# Altium schematic sheet [4]-MCU_POWER.SchDoc
size A4
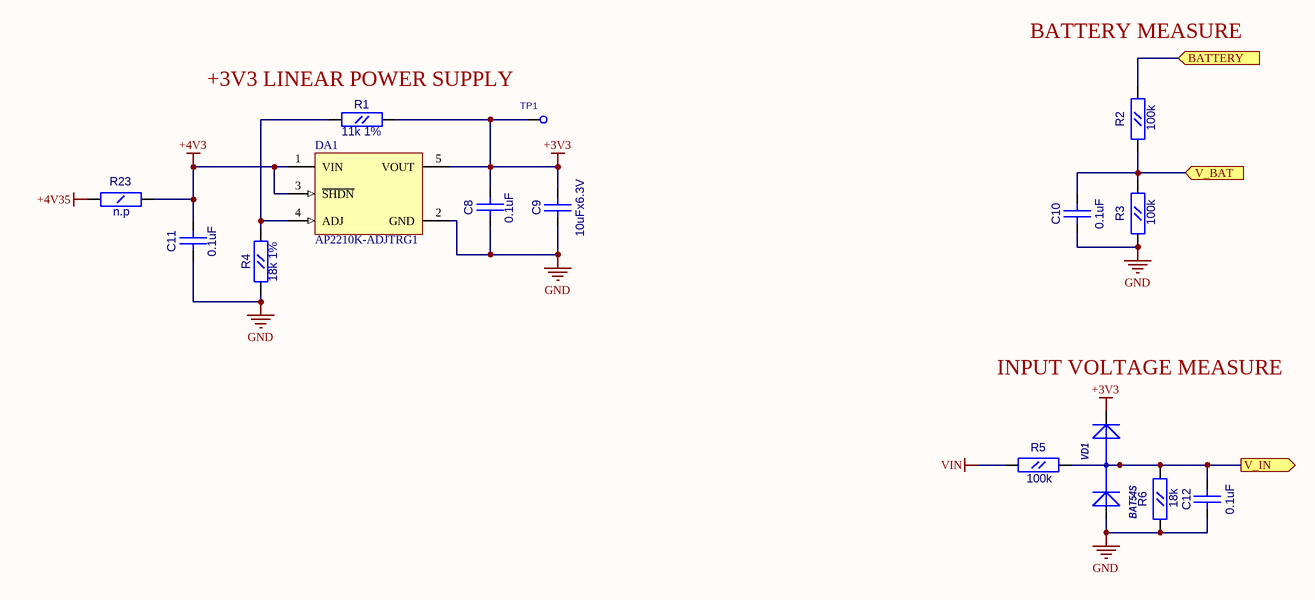
[diagram p0: [4]-MCU_POWER.SchDoc]

## Parts
C8  0.1uF  [CC0603]
C9  10uFx6.3V  [CC0805]
C10  0.1uF  [CC0603]
C11  0.1uF  [CC0603]
C12  0.1uF  [CC0603]
DA1  AP2210K-ADJTRG1  [SOT23-5]
R1  11k 1%  [RC0603]
R2  100k  [RC0603]
R3  100k  [RC0603]
R4  18k 1%  [RC0603]
R5  100k  [RC0603]
R6  18k  [RC0603]
R23  n.p  [RC1206]
TP1  TESTPOINT1  [TESTPOINT1]  (value not drawn)
VD1  BAT54S  [SOT-23(GSD)]

## Ports
BATTERY (in), V_BAT (in), V_IN (out)

## Nets
+3V3: C8.1(A) C9.2(B) DA1.5(VOUT) R1.2(B) TP1.1 VD1.2(K)
+4V3: C11.1(A) DA1.1(VIN) DA1.3(~{SHDN}) R23.2(B)
+4V35: R23.1(A)
GND: C8.2(B) C9.1(A) C10.1(A) C11.2(B) C12.1(A) DA1.2(GND) R3.1(A) R4.1(A) R6.1(A) VD1.1(A)
VIN: R5.1(A)
BATTERY: R2.2(B) ; port BATTERY
V_BAT: C10.2(B) R2.1(A) R3.2(B) ; port V_BAT
V_IN: C12.2(B) R5.2(B) R6.2(B) VD1.3(AK) ; port V_IN
NetDA1_4: DA1.4(ADJ) R1.1(A) R4.2(B)

## Notes on the sheet
- (near R1) +3V3 LINEAR POWER SUPPLY
- BATTERY MEASURE
- (near VD1) INPUT VOLTAGE MEASURE

## Library data of the parts
C8 C10-C12 = CC0603: Value: 0.1uF
C9 = CC0805: Value: 10uFx6.3V
DA1 = MCP1824T-ADJE/OT: 300 mA, Low Voltage, Low Quiescent Current LDO Regulator, 5-Pin SOT-223, Extended Temperature, Tape and Reel; Published: 29-Jan-2009; DatasheetVersion: revA, Aug-2007; PackageVersion: revAW, Oct-2008; PackageReference: SOT-223-DC5; Publisher: Altium Limited; PackageDescription: 5-Lead Plastic Small Outline Transistor (DC) [SOT-223]; ComponentLink1Description: Manufacturer Link; ComponentLink1URL: http://www.microchip.com; ComponentLink2Description: Datasheet; ComponentLink2URL: http://ww1.microchip.com/downloads/en/DeviceDoc/22070a.pdf; ComponentLink3Description: Packaging Specification; ComponentLink3URL: http://ww1.microchip.com/downloads/en/PackagingSpec/00049AW.pdf
R1-R6 = RC0603
  R1: Value: 11k 1%
  R2 R3 R5: Value: 100k
  R4: Value: 18k 1%
  R6: Value: 18k
R23 = RC1206: Value: n.p
VD1 = BAT54S: 1.0 Ampere General Purpose Rectifier; ComponentField6: Published 8-Jun-2000, Modified 11-July-2000: SIM Model Added.; Value: *
TP1 = TESTPOINT1: Value: *